# EasyEDA schematic SCH_SegaToys - ClearNote2 - PennyCart - 1_2022-05-10.json
TITLE: ClearNote2 - writeable cartridge; REV: 1.0; Date: 2022-05-10; Sheet: 1/1; Drawn By: Nox; Company: RedDashGames
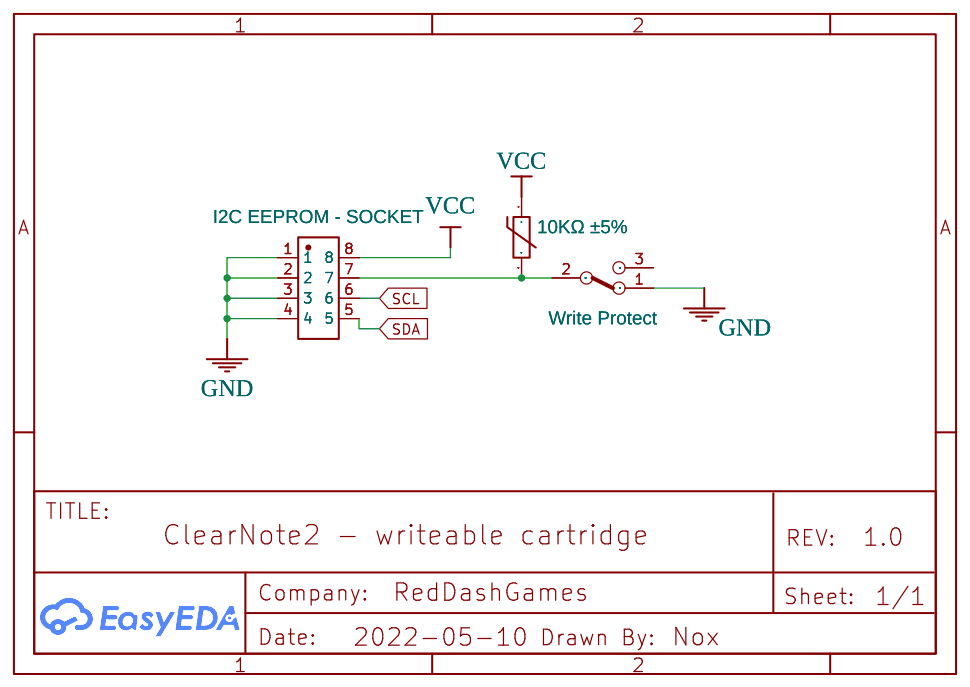
[diagram p0: schematic sheet]

## Parts
10K  10KΩ ±5%  [RES-TH_BD2.5-L4.7-P8.70-D0.5]
I2C-ROM  I2C EEPROM - SOCKET  [DIP-8_L10.2-W10.1-P2.54-LS7.6-BL-1]
PROTECT  Write Protect  [SLIDE_MINI_SWITCH]

## Library data of the parts
10K = 10KΩ ±5%_MF58: Supplier: LCSC; Supplier Part: C123392; Manufacturer: Nanjing Shiheng Elec; Manufacturer Part: MF58 103J3470; Contributor: LCSC; JLCPCB Part Class: Extended Part
I2C-ROM = X5621WV-2X04-C762D1000-1000: Supplier: LCSC; Supplier Part: C2883629; Manufacturer: XKB Connectivity(中国星坤); Manufacturer Part: X5621WV-2x04-C762D1000-1000; Contributor: LCSC; JLCPCB Part Class: Extended Part
PROTECT = Slide Switch SS12D00G3: Manufacturer Part: Switch SPDT; Contributor: update450; Mounted: No

## Nets
GND: I2C-ROM.1 I2C-ROM.2 I2C-ROM.3 I2C-ROM.4 PROTECT.1(C)
VCC: 10K.1 I2C-ROM.8
SCL: I2C-ROM.6
SDA: I2C-ROM.5
Net-(10K-2): 10K.2 I2C-ROM.7 PROTECT.2(NC)

Not connected (* = marked no-connect by the designer): PROTECT 3(NO)
